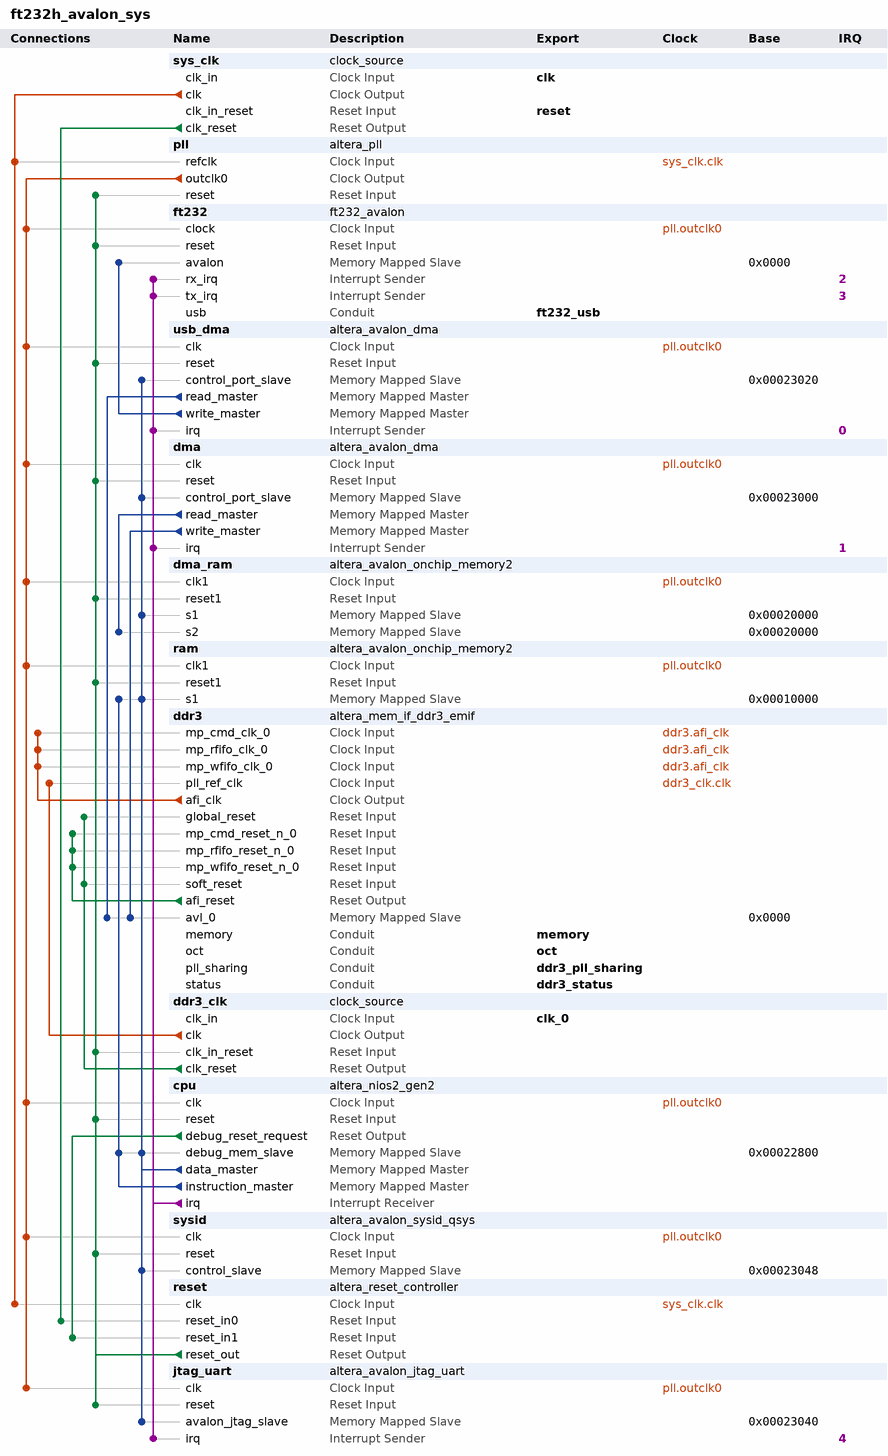
[diagram p0: system contents]
# Platform Designer (Qsys) system ft232h_avalon_sys, Cyclone V 5CEFA2F23C8
# Parameters at their usual value, and those the tool derives, are not listed.
package require -exact qsys 15.1
create_system ft232h_avalon_sys
set_project_property DEVICE_FAMILY {Cyclone V}
set_project_property DEVICE 5CEFA2F23C8

add_instance sys_clk clock_source 15.1
set_instance_parameter_value sys_clk clockFrequency 24000000

add_instance pll altera_pll 15.1
set_instance_parameter_value pll gui_device_speed_grade 8
set_instance_parameter_value pll gui_number_of_clocks 1
set_instance_parameter_value pll gui_operation_mode direct
set_instance_parameter_value pll gui_output_clock_frequency0 96.0
set_instance_parameter_value pll gui_pll_mode {Integer-N PLL}
set_instance_parameter_value pll gui_reference_clock_frequency 24.0
set_instance_parameter_value pll gui_use_locked false

add_instance ft232 ft232_avalon 1.0
set_instance_parameter_value ft232 CLEAR_IRQ 6
set_instance_parameter_value ft232 CONTROL 7
set_instance_parameter_value ft232 READ_DATA 0
set_instance_parameter_value ft232 RX_ALMOST_FULL_THRESHOLD 4
set_instance_parameter_value ft232 RX_FIFO_COUNTER 2
set_instance_parameter_value ft232 TX_ALMOST_EMPTY_THRESHOLD 5
set_instance_parameter_value ft232 TX_FIFO_COUNTER 3
set_instance_parameter_value ft232 WRITE_DATA 1

add_instance usb_dma altera_avalon_dma 15.1
set_instance_parameter_value usb_dma allowByteTransactions true
set_instance_parameter_value usb_dma allowDoubleWordTransactions true
set_instance_parameter_value usb_dma allowHalfWordTransactions true
set_instance_parameter_value usb_dma allowQuadWordTransactions true
set_instance_parameter_value usb_dma burstEnable false
set_instance_parameter_value usb_dma fifoDepth 32
set_instance_parameter_value usb_dma maxBurstSize 128
set_instance_parameter_value usb_dma minimumDmaTransactionRegisterWidth 13

add_instance dma altera_avalon_dma 15.1
set_instance_parameter_value dma allowByteTransactions true
set_instance_parameter_value dma allowDoubleWordTransactions true
set_instance_parameter_value dma allowHalfWordTransactions true
set_instance_parameter_value dma allowQuadWordTransactions true
set_instance_parameter_value dma burstEnable false
set_instance_parameter_value dma fifoDepth 32
set_instance_parameter_value dma maxBurstSize 128
set_instance_parameter_value dma minimumDmaTransactionRegisterWidth 13

add_instance dma_ram altera_avalon_onchip_memory2 15.1
set_instance_parameter_value dma_ram dataWidth 32
set_instance_parameter_value dma_ram dualPort true
set_instance_parameter_value dma_ram initMemContent true
set_instance_parameter_value dma_ram initializationFileName onchip_mem.hex
set_instance_parameter_value dma_ram memorySize 8192
set_instance_parameter_value dma_ram singleClockOperation true

add_instance ram altera_avalon_onchip_memory2 15.1
set_instance_parameter_value ram dataWidth 8
set_instance_parameter_value ram dualPort false
set_instance_parameter_value ram initMemContent true
set_instance_parameter_value ram initializationFileName onchip_mem.hex
set_instance_parameter_value ram memorySize 65536
set_instance_parameter_value ram singleClockOperation true

add_instance ddr3 altera_mem_if_ddr3_emif 15.1
set_instance_parameter_value ddr3 AVL_MAX_SIZE 4
set_instance_parameter_value ddr3 CALIBRATION_MODE Skip
set_instance_parameter_value ddr3 CPORT_TYPE_PORT Bidirectional,Bidirectional,Bidirectional,Bidirectional,Bidirectional,Bidirectional
set_instance_parameter_value ddr3 EXPORT_AFI_HALF_CLK false
set_instance_parameter_value ddr3 HARD_EMIF true
set_instance_parameter_value ddr3 MEM_BANKADDR_WIDTH 3
set_instance_parameter_value ddr3 MEM_CLK_FREQ 333.0
set_instance_parameter_value ddr3 MEM_CLK_FREQ_MAX 666.667
set_instance_parameter_value ddr3 MEM_COL_ADDR_WIDTH 10
set_instance_parameter_value ddr3 MEM_DQ_WIDTH 16
set_instance_parameter_value ddr3 MEM_DRV_STR RZQ/6
set_instance_parameter_value ddr3 MEM_FORMAT DISCRETE
set_instance_parameter_value ddr3 MEM_ROW_ADDR_WIDTH 13
set_instance_parameter_value ddr3 MEM_RTT_NOM {ODT Disabled}
set_instance_parameter_value ddr3 MEM_RTT_WR {Dynamic ODT off}
set_instance_parameter_value ddr3 MEM_TCL 7
set_instance_parameter_value ddr3 MEM_TFAW_NS 45.0
set_instance_parameter_value ddr3 MEM_TRAS_NS 36.0
set_instance_parameter_value ddr3 MEM_TRCD_NS 13.5
set_instance_parameter_value ddr3 MEM_TRFC_NS 110.0
set_instance_parameter_value ddr3 MEM_TRP_NS 13.5
set_instance_parameter_value ddr3 MEM_TRRD_NS 7.5
set_instance_parameter_value ddr3 MEM_TRTP_NS 7.5
set_instance_parameter_value ddr3 MEM_TWTR 5
set_instance_parameter_value ddr3 MEM_VENDOR Micron
set_instance_parameter_value ddr3 MEM_WTCL 6
set_instance_parameter_value ddr3 PLL_LOCATION Top_Bottom
set_instance_parameter_value ddr3 POWER_OF_TWO_BUS false
set_instance_parameter_value ddr3 PRIORITY_PORT 1,1,1,1,1,1
set_instance_parameter_value ddr3 RATE Full
set_instance_parameter_value ddr3 REF_CLK_FREQ 50.0
set_instance_parameter_value ddr3 SPEED_GRADE 8
set_instance_parameter_value ddr3 TIMING_BOARD_AC_SKEW 0.02
set_instance_parameter_value ddr3 TIMING_BOARD_AC_TO_CK_SKEW 0.0
set_instance_parameter_value ddr3 TIMING_BOARD_DQ_TO_DQS_SKEW 0.0
set_instance_parameter_value ddr3 TIMING_BOARD_MAX_CK_DELAY 0.6
set_instance_parameter_value ddr3 TIMING_BOARD_MAX_DQS_DELAY 0.6
set_instance_parameter_value ddr3 TIMING_BOARD_SKEW_BETWEEN_DQS 0.02
set_instance_parameter_value ddr3 TIMING_BOARD_SKEW_CKDQS_DIMM_MAX 0.01
set_instance_parameter_value ddr3 TIMING_BOARD_SKEW_CKDQS_DIMM_MIN -0.01
set_instance_parameter_value ddr3 TIMING_BOARD_SKEW_WITHIN_DQS 0.02
set_instance_parameter_value ddr3 TIMING_TDH 65
set_instance_parameter_value ddr3 TIMING_TDQSCK 255
set_instance_parameter_value ddr3 TIMING_TDQSQ 125
set_instance_parameter_value ddr3 TIMING_TDQSS 0.25
set_instance_parameter_value ddr3 TIMING_TDS 30
set_instance_parameter_value ddr3 TIMING_TDSH 0.2
set_instance_parameter_value ddr3 TIMING_TDSS 0.2
set_instance_parameter_value ddr3 TIMING_TIH 140
set_instance_parameter_value ddr3 TIMING_TIS 190
set_instance_parameter_value ddr3 TIMING_TQSH 0.4
set_instance_parameter_value ddr3 USER_DEBUG_LEVEL 1

add_instance ddr3_clk clock_source 15.1
set_instance_parameter_value ddr3_clk clockFrequency 50000000

add_instance cpu altera_nios2_gen2 15.1
set_instance_parameter_value cpu dcache_size 2048
set_instance_parameter_value cpu exceptionSlave ram.s1
set_instance_parameter_value cpu icache_size 4096
set_instance_parameter_value cpu impl Fast
set_instance_parameter_value cpu resetSlave ram.s1

add_instance sysid altera_avalon_sysid_qsys 15.1
set_instance_parameter_value sysid id -1792568025

add_instance reset altera_reset_controller 15.1
set_instance_parameter_value reset NUM_RESET_INPUTS 2
set_instance_parameter_value reset OUTPUT_RESET_SYNC_EDGES none
set_instance_parameter_value reset SYNC_DEPTH 2

add_instance jtag_uart altera_avalon_jtag_uart 15.1
set_instance_parameter_value jtag_uart simInteractiveOptions NO_INTERACTIVE_WINDOWS

# connections
add_connection ddr3.afi_clk ddr3.mp_cmd_clk_0 clock
add_connection ddr3.afi_clk ddr3.mp_rfifo_clk_0 clock
add_connection ddr3.afi_clk ddr3.mp_wfifo_clk_0 clock
add_connection ddr3_clk.clk ddr3.pll_ref_clk clock
add_connection pll.outclk0 cpu.clk clock
add_connection pll.outclk0 dma.clk clock
add_connection pll.outclk0 dma_ram.clk1 clock
add_connection pll.outclk0 ft232.clock clock
add_connection pll.outclk0 jtag_uart.clk clock
add_connection pll.outclk0 ram.clk1 clock
add_connection pll.outclk0 sysid.clk clock
add_connection pll.outclk0 usb_dma.clk clock
add_connection sys_clk.clk pll.refclk clock
add_connection sys_clk.clk reset.clk clock
add_connection cpu.debug_reset_request reset.reset_in1 reset
add_connection ddr3.afi_reset ddr3.mp_cmd_reset_n_0 reset
add_connection ddr3.afi_reset ddr3.mp_rfifo_reset_n_0 reset
add_connection ddr3.afi_reset ddr3.mp_wfifo_reset_n_0 reset
add_connection ddr3_clk.clk_reset ddr3.global_reset reset
add_connection ddr3_clk.clk_reset ddr3.soft_reset reset
add_connection reset.reset_out cpu.reset reset
add_connection reset.reset_out ddr3_clk.clk_in_reset reset
add_connection reset.reset_out dma.reset reset
add_connection reset.reset_out dma_ram.reset1 reset
add_connection reset.reset_out ft232.reset reset
add_connection reset.reset_out jtag_uart.reset reset
add_connection reset.reset_out pll.reset reset
add_connection reset.reset_out ram.reset1 reset
add_connection reset.reset_out sysid.reset reset
add_connection reset.reset_out usb_dma.reset reset
add_connection sys_clk.clk_reset reset.reset_in0 reset
add_connection cpu.data_master cpu.debug_mem_slave avalon
set_connection_parameter_value cpu.data_master/cpu.debug_mem_slave baseAddress 0x00022800
add_connection cpu.data_master dma.control_port_slave avalon
set_connection_parameter_value cpu.data_master/dma.control_port_slave baseAddress 0x00023000
add_connection cpu.data_master dma_ram.s1 avalon
set_connection_parameter_value cpu.data_master/dma_ram.s1 baseAddress 0x00020000
add_connection cpu.data_master jtag_uart.avalon_jtag_slave avalon
set_connection_parameter_value cpu.data_master/jtag_uart.avalon_jtag_slave baseAddress 0x00023040
add_connection cpu.data_master ram.s1 avalon
set_connection_parameter_value cpu.data_master/ram.s1 baseAddress 0x00010000
add_connection cpu.data_master sysid.control_slave avalon
set_connection_parameter_value cpu.data_master/sysid.control_slave baseAddress 0x00023048
add_connection cpu.data_master usb_dma.control_port_slave avalon
set_connection_parameter_value cpu.data_master/usb_dma.control_port_slave baseAddress 0x00023020
add_connection cpu.instruction_master cpu.debug_mem_slave avalon
set_connection_parameter_value cpu.instruction_master/cpu.debug_mem_slave baseAddress 0x00022800
add_connection cpu.instruction_master ram.s1 avalon
set_connection_parameter_value cpu.instruction_master/ram.s1 baseAddress 0x00010000
add_connection dma.read_master dma_ram.s2 avalon
set_connection_parameter_value dma.read_master/dma_ram.s2 baseAddress 0x00020000
add_connection dma.write_master ddr3.avl_0 avalon
set_connection_parameter_value dma.write_master/ddr3.avl_0 baseAddress 0x0000
add_connection usb_dma.read_master ddr3.avl_0 avalon
set_connection_parameter_value usb_dma.read_master/ddr3.avl_0 baseAddress 0x0000
add_connection usb_dma.write_master ft232.avalon avalon
set_connection_parameter_value usb_dma.write_master/ft232.avalon baseAddress 0x0000
add_connection cpu.irq dma.irq interrupt
set_connection_parameter_value cpu.irq/dma.irq irqNumber 1
add_connection cpu.irq ft232.rx_irq interrupt
set_connection_parameter_value cpu.irq/ft232.rx_irq irqNumber 2
add_connection cpu.irq ft232.tx_irq interrupt
set_connection_parameter_value cpu.irq/ft232.tx_irq irqNumber 3
add_connection cpu.irq jtag_uart.irq interrupt
set_connection_parameter_value cpu.irq/jtag_uart.irq irqNumber 4
add_connection cpu.irq usb_dma.irq interrupt
set_connection_parameter_value cpu.irq/usb_dma.irq irqNumber 0

# exported interfaces
add_interface clk clock sink
set_interface_property clk EXPORT_OF sys_clk.clk_in
add_interface clk_0 clock sink
set_interface_property clk_0 EXPORT_OF ddr3_clk.clk_in
add_interface ddr3_pll_sharing conduit end
set_interface_property ddr3_pll_sharing EXPORT_OF ddr3.pll_sharing
add_interface ddr3_status conduit end
set_interface_property ddr3_status EXPORT_OF ddr3.status
add_interface ft232_usb conduit end
set_interface_property ft232_usb EXPORT_OF ft232.usb
add_interface memory conduit end
set_interface_property memory EXPORT_OF ddr3.memory
add_interface oct conduit end
set_interface_property oct EXPORT_OF ddr3.oct
add_interface reset reset sink
set_interface_property reset EXPORT_OF sys_clk.clk_in_reset

set_interconnect_requirement {$system} qsys_mm.clockCrossingAdapter HANDSHAKE
set_interconnect_requirement {$system} qsys_mm.enableEccProtection FALSE
set_interconnect_requirement {$system} qsys_mm.insertDefaultSlave FALSE
set_interconnect_requirement {$system} qsys_mm.maxAdditionalLatency 1

save_system ft232h_avalon_sys.qsys
